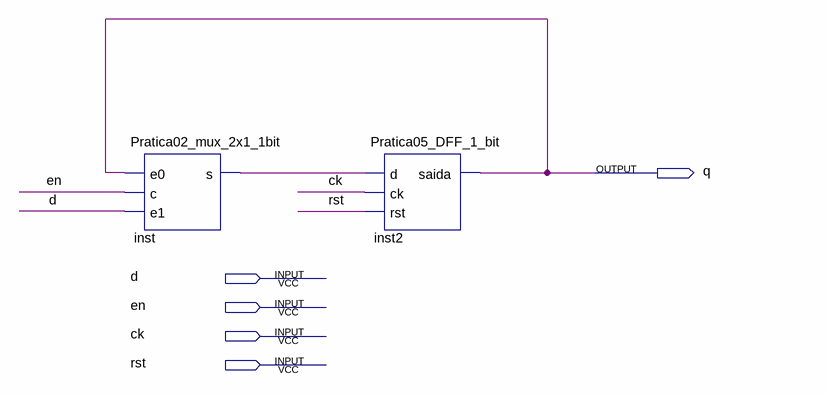
[diagram p0: schematic sheet]
// Quartus schematic Pratica05_reg_1_bit.bdf as structural Verilog: 2 symbols, 5 pins
module Pratica05_reg_1_bit (
  input  d,
  input  en,
  input  ck,
  input  rst,
  output q
);

  wire inst_s;

  Pratica02_mux_2x1_1bit inst (.e0(q), .c(en), .e1(d), .s(inst_s));
  Pratica05_DFF_1_bit inst2 (.d(inst_s), .ck(ck), .rst(rst), .saida(q));
endmodule
